# Altium schematic sheet debugging_board_3_ALL.SchDoc
size A4
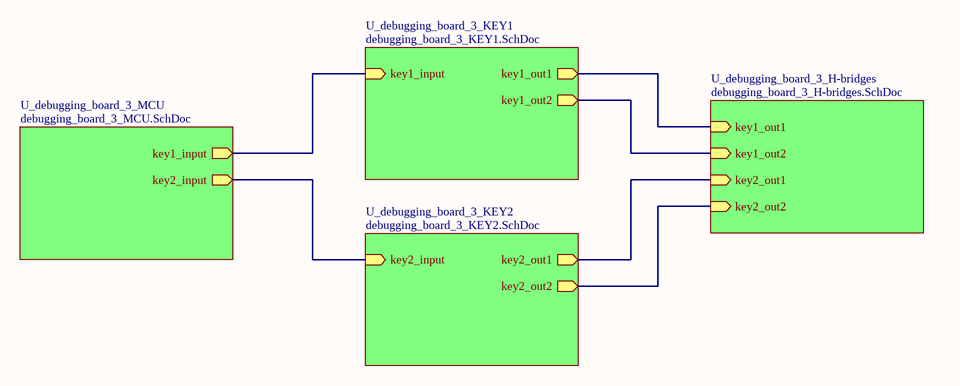
[diagram p0: debugging_board_3_ALL.SchDoc]

## Sub-sheets
U_debugging_board_3_H-bridges = debugging_board_3_H-bridges.SchDoc: key1_out1 (in), key1_out2 (in), key2_out1 (in), key2_out2 (in)
U_debugging_board_3_KEY1 = debugging_board_3_KEY1.SchDoc: key1_out1 (out), key1_out2 (out), key1_input (in)
U_debugging_board_3_KEY2 = debugging_board_3_KEY2.SchDoc: key2_out1 (out), key2_out2 (out), key2_input (in)
U_debugging_board_3_MCU = debugging_board_3_MCU.SchDoc: key1_input (out), key2_input (out)

## Nets
(unnamed): sheet U_debugging_board_3_MCU/key1_input, sheet U_debugging_board_3_KEY1/key1_input
(unnamed): sheet U_debugging_board_3_MCU/key2_input, sheet U_debugging_board_3_KEY2/key2_input
(unnamed): sheet U_debugging_board_3_H-bridges/key1_out1, sheet U_debugging_board_3_KEY1/key1_out1
(unnamed): sheet U_debugging_board_3_H-bridges/key1_out2, sheet U_debugging_board_3_KEY1/key1_out2
(unnamed): sheet U_debugging_board_3_H-bridges/key2_out1, sheet U_debugging_board_3_KEY2/key2_out1
(unnamed): sheet U_debugging_board_3_H-bridges/key2_out2, sheet U_debugging_board_3_KEY2/key2_out2